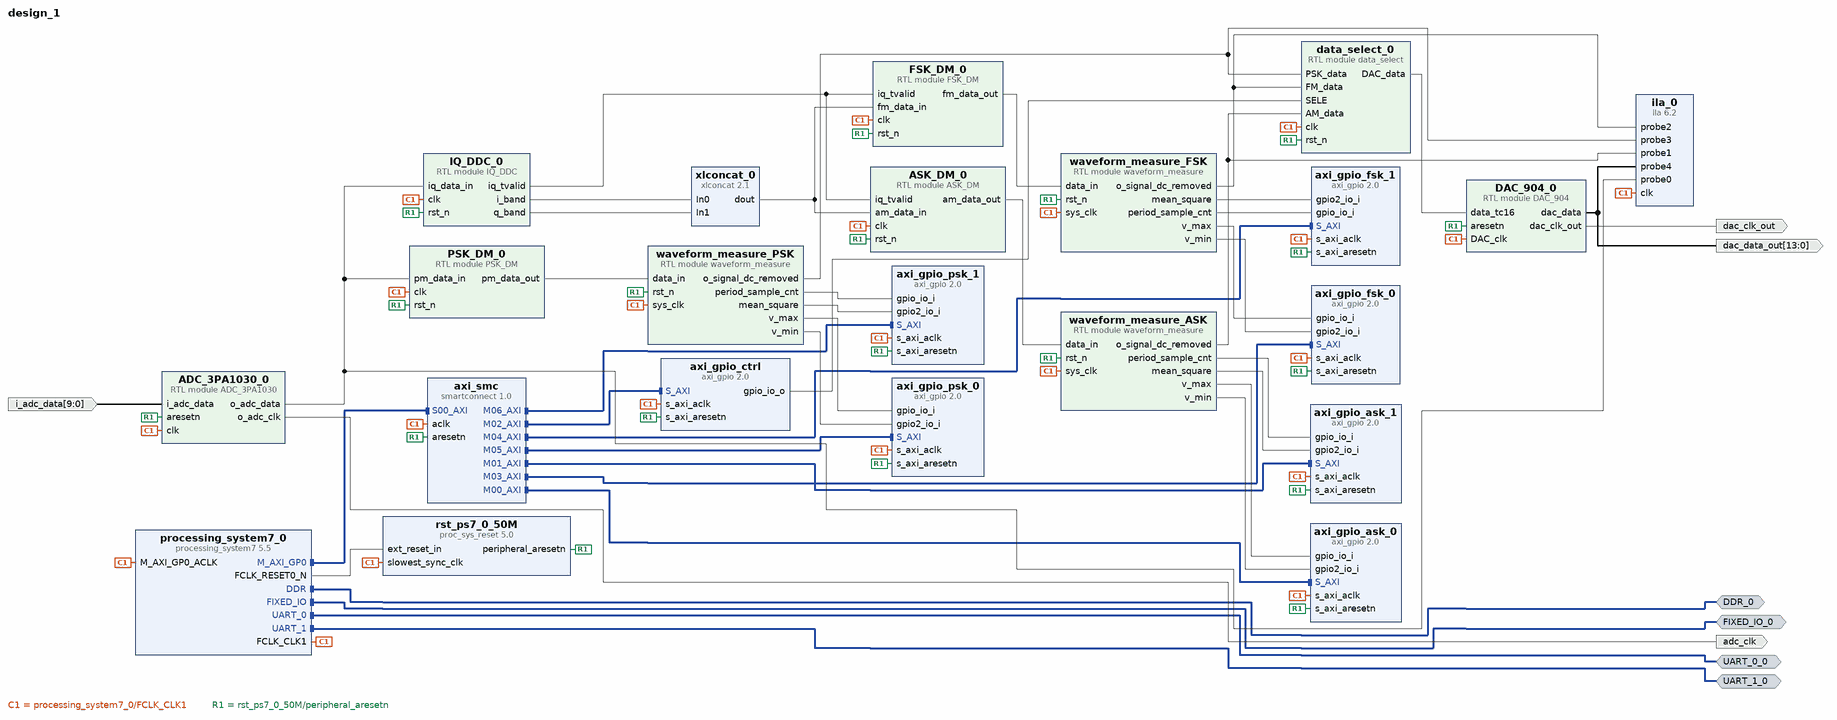
[diagram p0: block diagram of the top level]
# Vivado block design design_1, xc7z020clg484-1, Vivado 2024.2
create_bd_design design_1

create_bd_intf_port -mode Master -vlnv xilinx.com:display_processing_system7:fixedio_rtl:1.0 FIXED_IO_0
create_bd_intf_port -mode Master -vlnv xilinx.com:interface:ddrx_rtl:1.0 DDR_0
create_bd_intf_port -mode Master -vlnv xilinx.com:interface:uart_rtl:1.0 UART_0_0
create_bd_intf_port -mode Master -vlnv xilinx.com:interface:uart_rtl:1.0 UART_1_0
create_bd_port -dir I -from 9 -to 0 i_adc_data
create_bd_port -dir O -type clk adc_clk
create_bd_port -dir O dac_clk_out
create_bd_port -dir O -from 13 -to 0 dac_data_out

create_bd_cell -type module -reference PSK_DM PSK_DM_0
create_bd_cell -type module -reference FSK_DM FSK_DM_0
create_bd_cell -type module -reference ADC_3PA1030 ADC_3PA1030_0
create_bd_cell -type module -reference IQ_DDC IQ_DDC_0
create_bd_cell -type ip -vlnv xilinx.com:ip:xlconcat:2.1 xlconcat_0
set_property -dict {CONFIG.IN0_WIDTH 16 CONFIG.IN1_WIDTH 16} [get_bd_cells xlconcat_0]
create_bd_cell -type module -reference ASK_DM ASK_DM_0
create_bd_cell -type module -reference waveform_measure waveform_measure_ASK
set_property -dict {CONFIG.FRE_DIV 50 CONFIG.SAMPLE_NUM_WIDTH 13 CONFIG.SAMPLE_RATE 1000000} [get_bd_cells waveform_measure_ASK]
create_bd_cell -type module -reference waveform_measure waveform_measure_FSK
set_property -dict {CONFIG.FRE_DIV 50 CONFIG.SAMPLE_NUM_WIDTH 13 CONFIG.SAMPLE_RATE 1000000} [get_bd_cells waveform_measure_FSK]
create_bd_cell -type module -reference DAC_904 DAC_904_0
create_bd_cell -type ip -vlnv xilinx.com:ip:processing_system7:5.5 processing_system7_0
set_property -dict [list \
  CONFIG.PCW_APU_PERIPHERAL_FREQMHZ 666.666666 \
  CONFIG.PCW_ENET0_PERIPHERAL_ENABLE 0 \
  CONFIG.PCW_EN_CLK0_PORT 0 \
  CONFIG.PCW_EN_CLK1_PORT 1 \
  CONFIG.PCW_FCLK_CLK1_BUF TRUE \
  CONFIG.PCW_FPGA0_PERIPHERAL_FREQMHZ 50 \
  CONFIG.PCW_FPGA1_PERIPHERAL_FREQMHZ 50 \
  CONFIG.PCW_FPGA_FCLK1_ENABLE 1 \
  CONFIG.PCW_GPIO_MIO_GPIO_ENABLE 0 \
  CONFIG.PCW_PERIPHERAL_BOARD_PRESET None \
  CONFIG.PCW_PRESET_BANK1_VOLTAGE {LVCMOS 3.3V} \
  CONFIG.PCW_QSPI_PERIPHERAL_ENABLE 0 \
  CONFIG.PCW_SD0_PERIPHERAL_ENABLE 0 \
  CONFIG.PCW_UART0_PERIPHERAL_ENABLE 1 \
  CONFIG.PCW_UART0_UART0_IO EMIO \
  CONFIG.PCW_UART1_PERIPHERAL_ENABLE 1 \
  CONFIG.PCW_UART1_UART1_IO EMIO \
  CONFIG.PCW_UART_PERIPHERAL_FREQMHZ 100 \
  CONFIG.PCW_UIPARAM_DDR_BUS_WIDTH {16 Bit} \
  CONFIG.PCW_UIPARAM_DDR_FREQ_MHZ 533.333333 \
  CONFIG.PCW_UIPARAM_DDR_PARTNO {MT41J256M16 RE-125} \
  CONFIG.PCW_USB0_PERIPHERAL_ENABLE 0 \
  CONFIG.preset None \
] [get_bd_cells processing_system7_0]
# 326 more settings of processing_system7_0 are not shown: defaults, MIO pin electricals, DDR timing, and values the tool derives
create_bd_cell -type module -reference data_select data_select_0
create_bd_cell -type module -reference waveform_measure waveform_measure_PSK
set_property -dict {CONFIG.FRE_DIV 50 CONFIG.SAMPLE_NUM_WIDTH 13 CONFIG.SAMPLE_RATE 1000000} [get_bd_cells waveform_measure_PSK]
create_bd_cell -type ip -vlnv xilinx.com:ip:axi_gpio:2.0 axi_gpio_ask_0
set_property -dict [list \
  CONFIG.C_ALL_INPUTS 1 \
  CONFIG.C_ALL_INPUTS_2 1 \
  CONFIG.C_GPIO2_WIDTH 16 \
  CONFIG.C_GPIO_WIDTH 16 \
  CONFIG.C_IS_DUAL 1 \
] [get_bd_cells axi_gpio_ask_0]
create_bd_cell -type ip -vlnv xilinx.com:ip:axi_gpio:2.0 axi_gpio_ask_1
set_property -dict [list \
  CONFIG.C_ALL_INPUTS 1 \
  CONFIG.C_ALL_INPUTS_2 1 \
  CONFIG.C_GPIO2_WIDTH 32 \
  CONFIG.C_GPIO_WIDTH 16 \
  CONFIG.C_IS_DUAL 1 \
] [get_bd_cells axi_gpio_ask_1]
create_bd_cell -type ip -vlnv xilinx.com:ip:axi_gpio:2.0 axi_gpio_fsk_0
set_property -dict [list \
  CONFIG.C_ALL_INPUTS 1 \
  CONFIG.C_ALL_INPUTS_2 1 \
  CONFIG.C_GPIO2_WIDTH 16 \
  CONFIG.C_GPIO_WIDTH 16 \
  CONFIG.C_IS_DUAL 1 \
] [get_bd_cells axi_gpio_fsk_0]
create_bd_cell -type ip -vlnv xilinx.com:ip:axi_gpio:2.0 axi_gpio_fsk_1
set_property -dict [list \
  CONFIG.C_ALL_INPUTS 1 \
  CONFIG.C_ALL_INPUTS_2 1 \
  CONFIG.C_GPIO2_WIDTH 32 \
  CONFIG.C_GPIO_WIDTH 16 \
  CONFIG.C_IS_DUAL 1 \
] [get_bd_cells axi_gpio_fsk_1]
create_bd_cell -type ip -vlnv xilinx.com:ip:axi_gpio:2.0 axi_gpio_psk_1
set_property -dict [list \
  CONFIG.C_ALL_INPUTS 1 \
  CONFIG.C_ALL_INPUTS_2 1 \
  CONFIG.C_GPIO2_WIDTH 32 \
  CONFIG.C_GPIO_WIDTH 16 \
  CONFIG.C_IS_DUAL 1 \
] [get_bd_cells axi_gpio_psk_1]
create_bd_cell -type ip -vlnv xilinx.com:ip:proc_sys_reset:5.0 rst_ps7_0_50M
create_bd_cell -type ip -vlnv xilinx.com:ip:axi_gpio:2.0 axi_gpio_ctrl
set_property -dict [list \
  CONFIG.C_ALL_INPUTS 0 \
  CONFIG.C_ALL_OUTPUTS 1 \
  CONFIG.C_GPIO_WIDTH 16 \
  CONFIG.C_IS_DUAL 0 \
] [get_bd_cells axi_gpio_ctrl]
create_bd_cell -type ip -vlnv xilinx.com:ip:axi_gpio:2.0 axi_gpio_psk_0
set_property -dict [list \
  CONFIG.C_ALL_INPUTS 1 \
  CONFIG.C_ALL_INPUTS_2 1 \
  CONFIG.C_GPIO2_WIDTH 16 \
  CONFIG.C_GPIO_WIDTH 16 \
  CONFIG.C_IS_DUAL 1 \
] [get_bd_cells axi_gpio_psk_0]
create_bd_cell -type ip -vlnv xilinx.com:ip:smartconnect:1.0 axi_smc
set_property -dict {CONFIG.NUM_MI 7 CONFIG.NUM_SI 1} [get_bd_cells axi_smc]
create_bd_cell -type ip -vlnv xilinx.com:ip:ila:6.2 ila_0
set_property -dict [list \
  CONFIG.C_DATA_DEPTH 32768 \
  CONFIG.C_MONITOR_TYPE Native \
  CONFIG.C_NUM_OF_PROBES 5 \
  CONFIG.C_PROBE0_WIDTH 16 \
  CONFIG.C_PROBE1_WIDTH 16 \
  CONFIG.C_PROBE2_WIDTH 16 \
  CONFIG.C_PROBE3_WIDTH 16 \
  CONFIG.C_PROBE4_WIDTH 14 \
] [get_bd_cells ila_0]

# ---- connections ----

connect_bd_intf_net [get_bd_intf_pins axi_smc/M00_AXI] [get_bd_intf_pins axi_gpio_ask_0/S_AXI]
connect_bd_intf_net [get_bd_intf_pins axi_smc/M01_AXI] [get_bd_intf_pins axi_gpio_ask_1/S_AXI]
connect_bd_intf_net [get_bd_intf_pins axi_smc/M02_AXI] [get_bd_intf_pins axi_gpio_ctrl/S_AXI]
connect_bd_intf_net [get_bd_intf_pins axi_smc/M03_AXI] [get_bd_intf_pins axi_gpio_fsk_0/S_AXI]
connect_bd_intf_net [get_bd_intf_pins axi_smc/M04_AXI] [get_bd_intf_pins axi_gpio_fsk_1/S_AXI]
connect_bd_intf_net [get_bd_intf_pins axi_smc/M05_AXI] [get_bd_intf_pins axi_gpio_psk_0/S_AXI]
connect_bd_intf_net [get_bd_intf_pins axi_smc/M06_AXI] [get_bd_intf_pins axi_gpio_psk_1/S_AXI]
connect_bd_intf_net [get_bd_intf_ports DDR_0] [get_bd_intf_pins processing_system7_0/DDR]
connect_bd_intf_net [get_bd_intf_ports FIXED_IO_0] [get_bd_intf_pins processing_system7_0/FIXED_IO]
connect_bd_intf_net [get_bd_intf_pins processing_system7_0/M_AXI_GP0] [get_bd_intf_pins axi_smc/S00_AXI]
connect_bd_intf_net [get_bd_intf_ports UART_0_0] [get_bd_intf_pins processing_system7_0/UART_0]
connect_bd_intf_net [get_bd_intf_ports UART_1_0] [get_bd_intf_pins processing_system7_0/UART_1]
connect_bd_net -net ADC_3PA1030_0_adc_data_out [get_bd_pins ADC_3PA1030_0/o_adc_data] \
  [get_bd_pins IQ_DDC_0/iq_data_in] [get_bd_pins PSK_DM_0/pm_data_in] [get_bd_pins ila_0/probe0]
connect_bd_net [get_bd_pins ADC_3PA1030_0/o_adc_clk] [get_bd_ports adc_clk]
connect_bd_net [get_bd_pins ASK_DM_0/am_data_out] [get_bd_pins waveform_measure_ASK/data_in]
connect_bd_net [get_bd_pins DAC_904_0/dac_clk_out] [get_bd_ports dac_clk_out]
connect_bd_net [get_bd_pins DAC_904_0/dac_data] [get_bd_ports dac_data_out] [get_bd_pins ila_0/probe4]
connect_bd_net -net FSK_DM_0_data_out_17 [get_bd_pins FSK_DM_0/fm_data_out] [get_bd_pins waveform_measure_FSK/data_in]
connect_bd_net [get_bd_pins IQ_DDC_0/i_band] [get_bd_pins xlconcat_0/In0]
connect_bd_net [get_bd_pins IQ_DDC_0/iq_tvalid] [get_bd_pins ASK_DM_0/iq_tvalid] [get_bd_pins FSK_DM_0/iq_tvalid]
connect_bd_net [get_bd_pins IQ_DDC_0/q_band] [get_bd_pins xlconcat_0/In1]
connect_bd_net [get_bd_pins PSK_DM_0/pm_data_out] [get_bd_pins waveform_measure_PSK/data_in]
connect_bd_net -net axi_gpio_select_gpio_io_o [get_bd_pins axi_gpio_ctrl/gpio_io_o] [get_bd_pins data_select_0/SELE]
connect_bd_net -net clk_wiz_0_clk_out1 [get_bd_pins processing_system7_0/FCLK_CLK1] \
  [get_bd_pins IQ_DDC_0/clk] [get_bd_pins processing_system7_0/M_AXI_GP0_ACLK] [get_bd_pins axi_gpio_ask_0/s_axi_aclk] \
  [get_bd_pins rst_ps7_0_50M/slowest_sync_clk] [get_bd_pins axi_gpio_ask_1/s_axi_aclk] \
  [get_bd_pins axi_gpio_fsk_0/s_axi_aclk] [get_bd_pins axi_gpio_fsk_1/s_axi_aclk] [get_bd_pins axi_gpio_psk_1/s_axi_aclk] \
  [get_bd_pins ADC_3PA1030_0/clk] [get_bd_pins ASK_DM_0/clk] [get_bd_pins FSK_DM_0/clk] \
  [get_bd_pins waveform_measure_ASK/sys_clk] [get_bd_pins waveform_measure_FSK/sys_clk] \
  [get_bd_pins waveform_measure_PSK/sys_clk] [get_bd_pins axi_gpio_psk_0/s_axi_aclk] [get_bd_pins PSK_DM_0/clk] \
  [get_bd_pins axi_gpio_ctrl/s_axi_aclk] [get_bd_pins axi_smc/aclk] [get_bd_pins ila_0/clk] [get_bd_pins data_select_0/clk] \
  [get_bd_pins DAC_904_0/DAC_clk]
connect_bd_net [get_bd_pins data_select_0/DAC_data] [get_bd_pins DAC_904_0/data_tc16]
connect_bd_net -net i_adc_data_0_1 [get_bd_ports i_adc_data] [get_bd_pins ADC_3PA1030_0/i_adc_data]
connect_bd_net [get_bd_pins processing_system7_0/FCLK_RESET0_N] [get_bd_pins rst_ps7_0_50M/ext_reset_in]
connect_bd_net [get_bd_pins rst_ps7_0_50M/peripheral_aresetn] \
  [get_bd_pins axi_gpio_ask_0/s_axi_aresetn] [get_bd_pins axi_gpio_ask_1/s_axi_aresetn] \
  [get_bd_pins axi_gpio_fsk_0/s_axi_aresetn] [get_bd_pins axi_gpio_fsk_1/s_axi_aresetn] \
  [get_bd_pins axi_gpio_psk_1/s_axi_aresetn] [get_bd_pins ADC_3PA1030_0/aresetn] [get_bd_pins ASK_DM_0/rst_n] \
  [get_bd_pins FSK_DM_0/rst_n] [get_bd_pins IQ_DDC_0/rst_n] [get_bd_pins waveform_measure_ASK/rst_n] \
  [get_bd_pins waveform_measure_FSK/rst_n] [get_bd_pins waveform_measure_PSK/rst_n] \
  [get_bd_pins axi_gpio_psk_0/s_axi_aresetn] [get_bd_pins PSK_DM_0/rst_n] [get_bd_pins axi_gpio_ctrl/s_axi_aresetn] \
  [get_bd_pins axi_smc/aresetn] [get_bd_pins data_select_0/rst_n] [get_bd_pins DAC_904_0/aresetn]
connect_bd_net -net waveform_measure_ASK_frequency [get_bd_pins waveform_measure_ASK/period_sample_cnt] [get_bd_pins axi_gpio_ask_1/gpio_io_i]
connect_bd_net [get_bd_pins waveform_measure_ASK/mean_square] [get_bd_pins axi_gpio_ask_1/gpio2_io_i]
connect_bd_net [get_bd_pins waveform_measure_ASK/o_signal_dc_removed] [get_bd_pins ila_0/probe1] [get_bd_pins data_select_0/AM_data]
connect_bd_net [get_bd_pins waveform_measure_ASK/v_max] [get_bd_pins axi_gpio_ask_0/gpio_io_i]
connect_bd_net [get_bd_pins waveform_measure_ASK/v_min] [get_bd_pins axi_gpio_ask_0/gpio2_io_i]
connect_bd_net [get_bd_pins waveform_measure_FSK/mean_square] [get_bd_pins axi_gpio_fsk_1/gpio2_io_i]
connect_bd_net [get_bd_pins waveform_measure_FSK/o_signal_dc_removed] [get_bd_pins ila_0/probe2] [get_bd_pins data_select_0/FM_data]
connect_bd_net [get_bd_pins waveform_measure_FSK/period_sample_cnt] [get_bd_pins axi_gpio_fsk_1/gpio_io_i]
connect_bd_net [get_bd_pins waveform_measure_FSK/v_max] [get_bd_pins axi_gpio_fsk_0/gpio_io_i]
connect_bd_net [get_bd_pins waveform_measure_FSK/v_min] [get_bd_pins axi_gpio_fsk_0/gpio2_io_i]
connect_bd_net -net waveform_measure_PSK_frequency [get_bd_pins waveform_measure_PSK/period_sample_cnt] [get_bd_pins axi_gpio_psk_1/gpio_io_i]
connect_bd_net [get_bd_pins waveform_measure_PSK/mean_square] [get_bd_pins axi_gpio_psk_1/gpio2_io_i]
connect_bd_net [get_bd_pins waveform_measure_PSK/o_signal_dc_removed] [get_bd_pins ila_0/probe3] [get_bd_pins data_select_0/PSK_data]
connect_bd_net [get_bd_pins waveform_measure_PSK/v_max] [get_bd_pins axi_gpio_psk_0/gpio_io_i]
connect_bd_net [get_bd_pins waveform_measure_PSK/v_min] [get_bd_pins axi_gpio_psk_0/gpio2_io_i]
connect_bd_net [get_bd_pins xlconcat_0/dout] [get_bd_pins ASK_DM_0/am_data_in] [get_bd_pins FSK_DM_0/fm_data_in]

# ---- address map ----
assign_bd_address -offset 0x41200000 -range 64K -target_address_space [get_bd_addr_spaces processing_system7_0/Data] [get_bd_addr_segs axi_gpio_ask_0/S_AXI/Reg]
assign_bd_address -offset 0x41210000 -range 64K -target_address_space [get_bd_addr_spaces processing_system7_0/Data] [get_bd_addr_segs axi_gpio_ask_1/S_AXI/Reg]
assign_bd_address -offset 0x41220000 -range 64K -target_address_space [get_bd_addr_spaces processing_system7_0/Data] [get_bd_addr_segs axi_gpio_fsk_0/S_AXI/Reg]
assign_bd_address -offset 0x41230000 -range 64K -target_address_space [get_bd_addr_spaces processing_system7_0/Data] [get_bd_addr_segs axi_gpio_fsk_1/S_AXI/Reg]
assign_bd_address -offset 0x41240000 -range 64K -target_address_space [get_bd_addr_spaces processing_system7_0/Data] [get_bd_addr_segs axi_gpio_psk_1/S_AXI/Reg]
assign_bd_address -offset 0x41250000 -range 64K -target_address_space [get_bd_addr_spaces processing_system7_0/Data] [get_bd_addr_segs axi_gpio_ctrl/S_AXI/Reg]
assign_bd_address -offset 0x41260000 -range 64K -target_address_space [get_bd_addr_spaces processing_system7_0/Data] [get_bd_addr_segs axi_gpio_psk_0/S_AXI/Reg]

validate_bd_design
save_bd_design
